# EAGLE design Module (EAGLE 7.2.0)
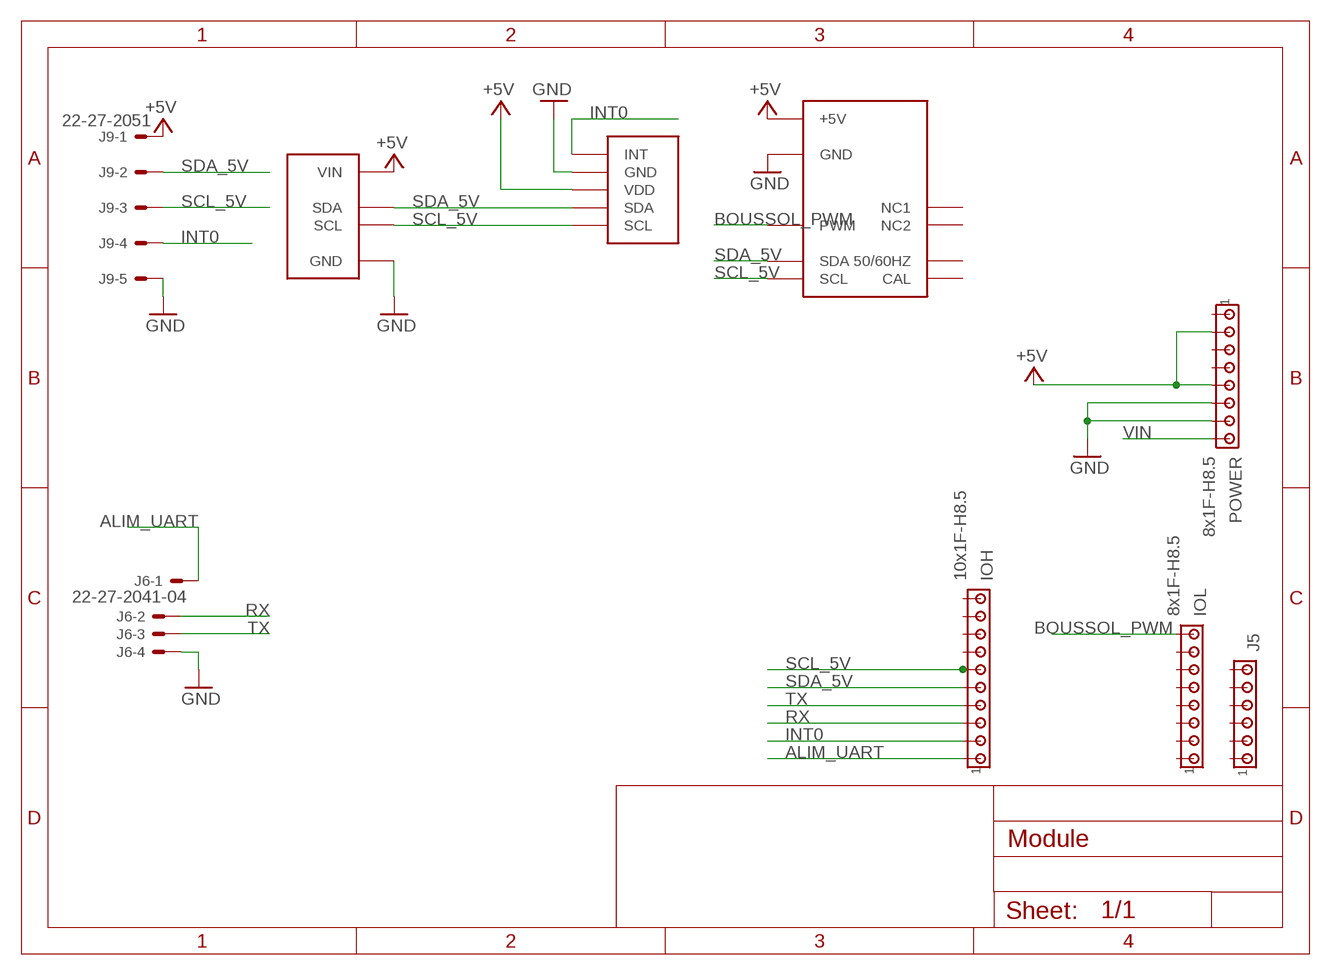
[diagram p0: schematic, sheet 1]

## Parts
IOH  10x1F-H8.5  MTA10-100  [10X10MTA]
IOL  8x1F-H8.5  MTA08-100  [10X08MTA]
J5  MTA06-100  [10X06MTA]
J6  22-27-2041-04  [6410-04]
J9  22-27-2051  22-27-2051-05  [6410-05]
POWER  8x1F-H8.5  MTA08-100  [10X08MTA]
U$1  SRF10  [SRF10]
U$2  MPU9150  [MPU9150]
U$6  CMPS03  [CMPS03]

## Nets
+5V: J9.1 POWER.2 POWER.5 U$1.P$4(VIN) U$2.P$3(VDD) U$6.P$1(+5V)
ALIM_UART: IOH.1 J6.1
BOUSSOL_PWM: IOL.8 U$6.P$4(PWM)
GND: J6.4 J9.5 POWER.6 POWER.7 U$1.P$1(GND) U$2.P$2(GND) U$6.P$9(GND)
INT0: IOH.2 J9.4 U$2.P$1(INT)
RX: IOH.3 J6.2
SCL_5V: IOH.6 J9.3 U$1.P$2(SCL) U$2.P$5(SCL) U$6.P$2(SCL)
SDA_5V: IOH.5 J9.2 U$1.P$3(SDA) U$2.P$4(SDA) U$6.P$3(SDA)
TX: IOH.4 J6.3
VIN: POWER.8
Unconnected: IOH.7 IOH.8 IOH.9 IOH.10 IOL.1 IOL.2 IOL.3 IOL.4 IOL.5 IOL.6 IOL.7 J5.1 J5.2 J5.3 J5.4 J5.5 J5.6 POWER.1 POWER.3 POWER.4 U$6.P$5(NC1) U$6.P$6(CAL) U$6.P$7(50/60HZ) U$6.P$8(NC2)

## Library data of the parts
IOH = LibPerso:MTA10-100: AMP connector; OC_FARNELL: 1593464
IOL POWER = LibPerso:MTA08-100: AMP connector; OC_FARNELL: 1593463
J5 = LibPerso:MTA06-100: AMP connector; OC_FARNELL: 1593462
J6 = con-molex:22-?-04: CONNECTOR wire to board 2.54 mm (.1 inch) pitch header; OC_FARNELL: unknown; OC_NEWARK: unknown
J9 = con-molex:22-?-05: CONNECTOR wire to board 2.54 mm (.1 inch) pitch header; OC_FARNELL: unknown; OC_NEWARK: unknown
U$1 = LibPerso:SRF10
U$2 = LibPerso:MPU9150
U$6 = LibPerso:CMPS03

## Net classes
0 default: width 0.254 mm, clearance 0.254 mm
1 power: width 0.61 mm, drill 0.61 mm, clearance 0.254 mm
2 gnd: width 0.305 mm, drill 0.559 mm, clearance 0.254 mm
3 usbvcc: width 0.508 mm, drill 0.61 mm, clearance 0.254 mm
4 aref: width 0.406 mm, drill 0.61 mm, clearance 0.254 mm

## Board
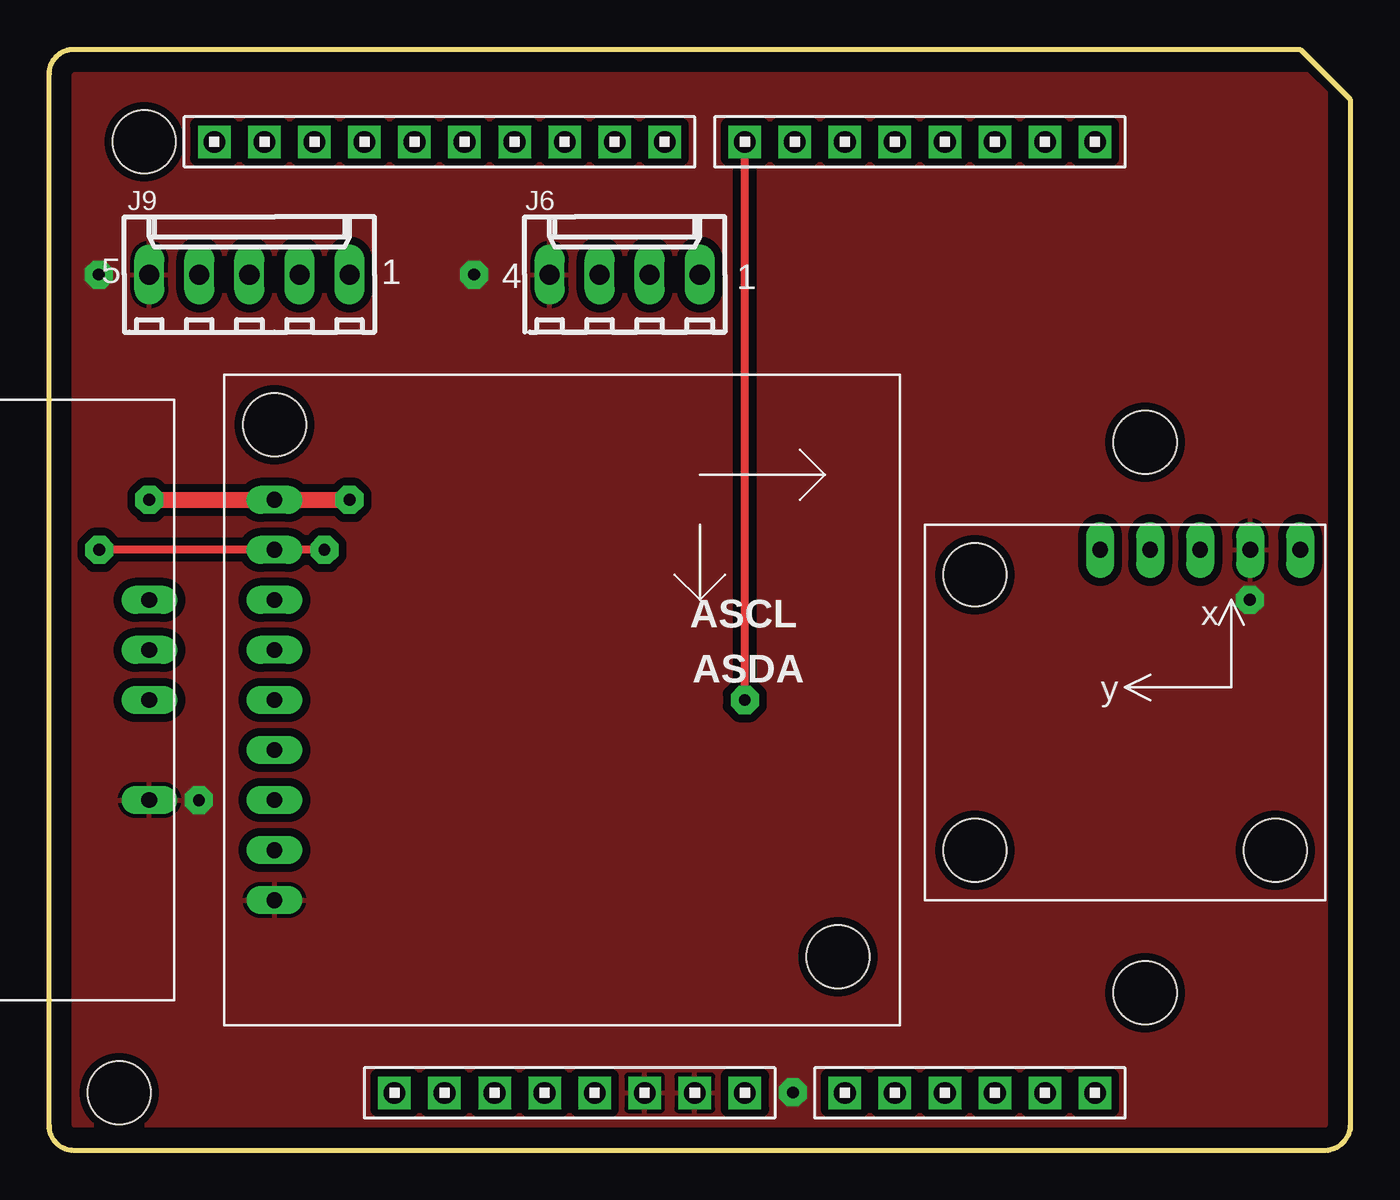
[diagram p1: board, top side]
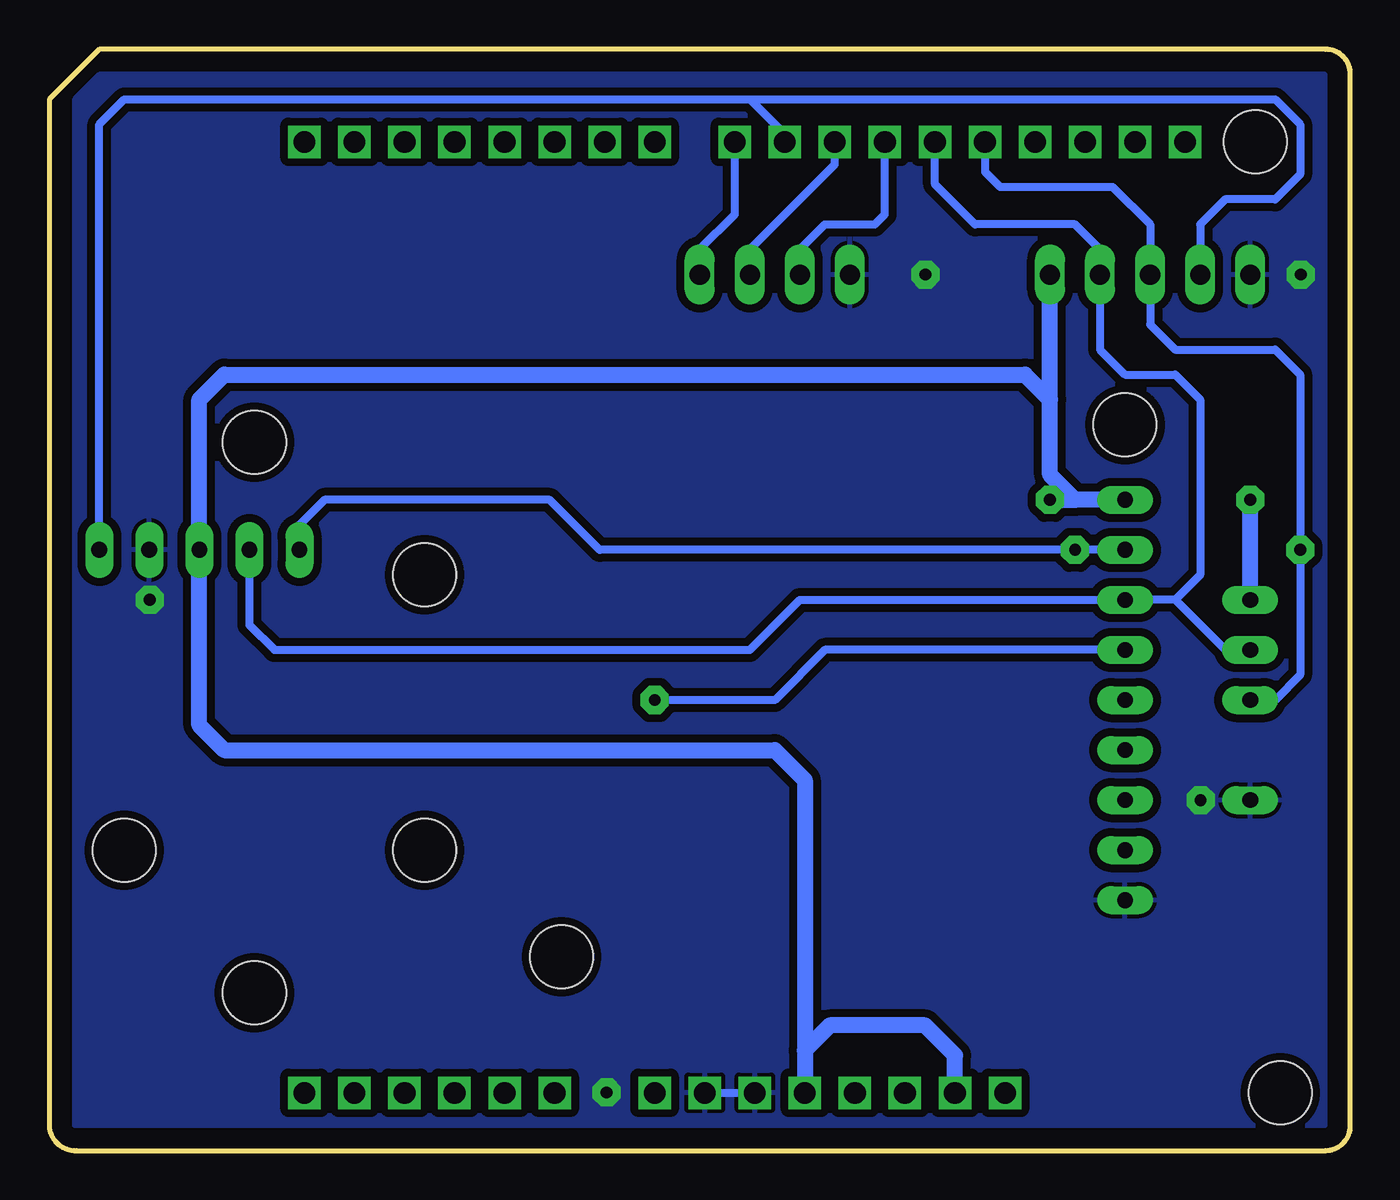
[diagram p2: board, bottom side, seen from below]

Size 66.04 x 55.88 mm. Coordinates in mm from the lower left corner, seen from the top.
Outline: 0,1.25 arc90 1.25,0 64.66,0 arc90 66.04,1.25 66.04,53.34 63.5,55.88 1.25,55.88 arc90 0,54.63 0,1.27
Copper layers (1*16): Top 0.018mm / dielectric 1.55mm / Bottom 0.018mm
Design rules "eC_2Layer_PClass6_BaseCopperO18_eCDefault": minimum track width 0.15mm, minimum drill 0.35mm, track to track 0.15mm, track to pad 0.15mm, pad to pad 0.15mm, via to via 0.15mm, smd to smd 0mil, copper to edge 0.25mm, drill to drill 0.35mm, minimum pad ring 0.175mm, minimum via ring 0.125mm, stop-mask expansion 0mil, vias tented up to drill 0.45mm, thermal gap 0.2mm
Holes 3.2 mm at 55.63,35.94 55.63,8 4.83,51.18 3.56,2.92

### Footprints (pad centres in the part's own frame; a part is rotated, then mirrored left to right if it is on the bottom)
10X10MTA = drill 1.1 square: 1 11.43,0; 2 8.89,0; 3 6.35,0; 4 3.81,0; 5 1.27,0; 6 -1.27,0; 7 -3.81,0; 8 -6.35,0; 9 -8.89,0; 10 -11.43,0
10X08MTA = drill 1.1 square: 1 8.89,0; 2 6.35,0; 3 3.81,0; 4 1.27,0; 5 -1.27,0; 6 -3.81,0; 7 -6.35,0; 8 -8.89,0
10X06MTA = drill 1.1 square: 1 6.35,0; 2 3.81,0; 3 1.27,0; 4 -1.27,0; 5 -3.81,0; 6 -6.35,0
6410-04 = drill 1.016 long: 1 3.81,0; 2 1.27,0; 3 -1.27,0; 4 -3.81,0
6410-05 = drill 1.016 long: 1 5.08,0; 2 2.54,0; 3 0,0; 4 -2.54,0; 5 -5.08,0
SRF10 = drill 0.8 pad 1.422 long: P$1 0,0; P$2 5.08,0; P$3 7.62,0; P$4 10.16,0
MPU9150 = drill 0.8 pad 1.422 long: P$1 0,0; P$2 2.54,0; P$3 5.08,0; P$4 7.62,0; P$5 10.16,0 | hole 3.2: 16.51,1.27; 16.51,15.24; 1.27,15.24
CMPS03 = drill 0.8 pad 1.422 long: P$1 0,3.81; P$2 0,6.35; P$3 0,8.89; P$4 0,11.43; P$5 0,13.97; P$6 0,16.51; P$7 0,19.05; P$8 0,21.59; P$9 0,24.13 | hole 3.2: 0,0; -28.6,27

### Placement (x,y rotation side)
IOH  19.81,51.18 0 top
IOL  44.2,51.18 0 top
J5  46.74,2.92 0 top
J6  29.21,44.45 0 top
J9  10.16,44.45 0 top
POWER  26.42,2.92 180 top
U$1  5.08,17.78 90 top
U$2  63.5,30.48 180 top
U$6  11.43,36.83 180 top

### Tracks (layer width: path | path; a pad name or v marks a point on that pad's centre or on a via)
+5V  (via drill 0.6 pad 1.42)
  Top 0.813: v5.08,33.02 v15.24,33.02
  Bottom 0.813: 27.69,5.08 27.69,18.8 29.21,20.32 57.15,20.32 58.42,21.59 U$2.P$3 58.42,38.1 57.15,39.37 16.51,39.37 15.24,38.1 | 27.69,5.08 POWER.5 | U$6.P$1 13.97,33.02 | 13.97,33.02 15.24,34.29 15.24,38.1 | 15.24,38.1 J9.1 | U$1.P$4 v5.08,33.02 | v15.24,33.02 13.97,33.02 | POWER.2 20.07,4.83 21.59,6.35 26.42,6.35 27.69,5.08
ALIM_UART
  Bottom 0.406: J6.1 33.02,45.72 31.24,47.5 IOH.1
BOUSSOL_PWM  (via drill 0.6 pad 1.42)
  Top 0.406: v35.31,22.86 IOL.8
  Bottom 0.406: U$6.P$4 26.67,25.4 29.21,22.86 v35.31,22.86
GND  (via drill 0.6 pad 1.42)
  Bottom 0.406: POWER.7 POWER.6
  other vias: 37.74,2.95 21.56,44.45 2.51,44.45 7.59,17.78 60.93,27.94
  pour Bottom (isolate 0.406, rank 2): 1.27,54.61 63.5,54.61 64.77,53.34 64.77,1.27 1.27,1.27
  pour Top (isolate 0.406, rank 2): 1.27,54.61 64.77,54.61 64.77,1.27 1.27,1.27
INT0
  Bottom 0.406: U$2.P$1 63.5,52.07 62.23,53.34 30.48,53.34 | 30.48,53.34 3.81,53.34 2.54,52.07 2.54,49.53 3.81,48.26 6.35,48.26 7.62,46.99 J9.4 | IOH.2 28.7,51.56 30.48,53.34
RX
  Bottom 0.406: J6.2 30.48,45.72 26.16,50.04 IOH.3
SCL_5V  (via drill 0.6 pad 1.42)
  Top 0.406: v13.97,30.48 v2.54,30.48
  Bottom 0.406: IOH.6 18.54,49.66 17.78,48.9 12.07,48.9 10.16,46.99 J9.3 10.16,41.91 8.89,40.64 3.81,40.64 2.54,39.37 v2.54,30.48 2.54,24.13 3.81,22.86 U$1.P$2 | U$2.P$5 53.34,31.75 52.07,33.02 40.64,33.02 38.1,30.48 v13.97,30.48 U$6.P$2
SDA_5V
  Bottom 0.406: IOH.5 21.08,49.02 19.05,46.99 13.97,46.99 12.7,45.72 J9.2 12.7,40.64 11.43,39.37 8.89,39.37 7.62,38.1 7.62,29.21 8.89,27.94 | U$2.P$4 55.88,26.67 54.61,25.4 30.48,25.4 27.94,27.94 U$6.P$3 8.89,27.94 | U$1.P$3 6.35,25.4 8.89,27.94
TX
  Bottom 0.406: J6.3 27.94,45.72 26.67,46.99 24.13,46.99 23.62,47.5 IOH.4

### Text on the board
tNames: ASCL | ASDA
214bmp: D:/SmartProjects/Snc/a4_bn_logo2.bmp